# EAGLE schematic Main (EAGLE 8.6.1)
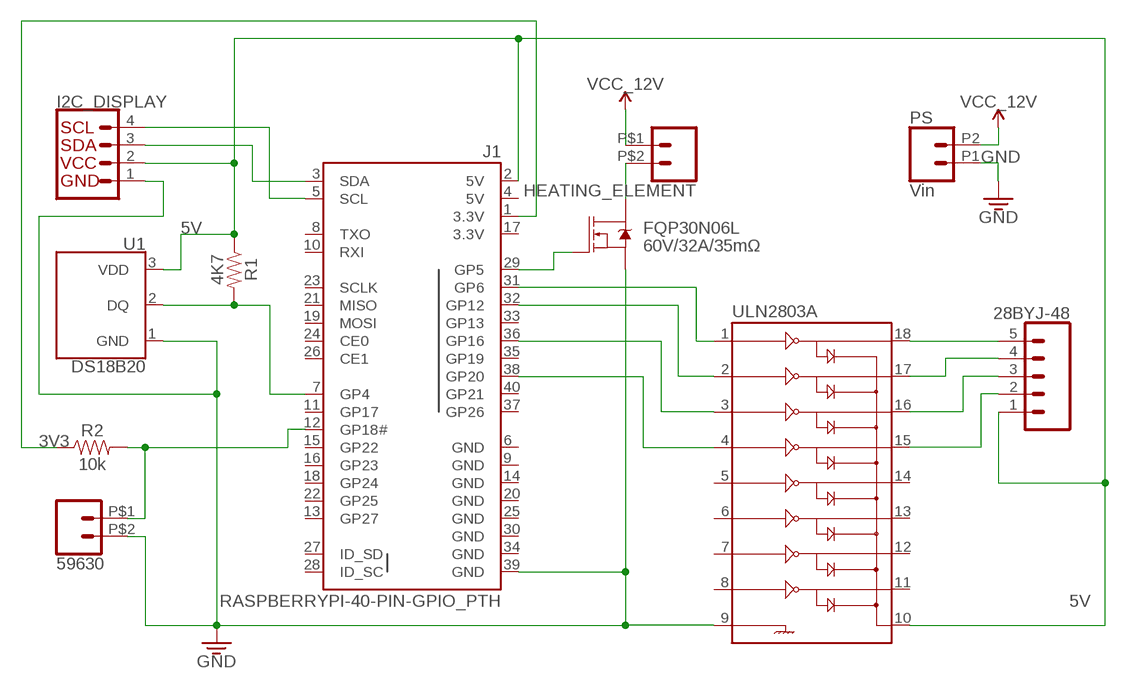
[diagram p0: schematic, sheet 1]

## Parts
28BYJ-48  CONN_05SCREW  [SCREWTERMINAL-3.5MM-5]
59630  CONN_02PTH2  [1X02_BIG]
FQP30N06L  60V/32A/35mΩ  MOSFET-NCH-FQP30N06L  [TO220V]
HEATING_ELEMENT  CONN_02PTH2  [1X02_BIG]
I2C_DISPLAY  I2C_STANDARD  [1X04]
J1  RASPBERRYPI-40-PIN-GPIO_PTH  [2X20_SHROUDED]
PS  Vin  CONN_022.54MM_SCREWTERM  [1X02_2.54_SCREWTERM]
R1  4K7  RESISTORAXIAL-0.3  [AXIAL-0.3]
R2  10k  10KOHM-HORIZ-1/4W-1%  [AXIAL-0.3]
U1  DS18B20  [TO-92-AMMO]
ULN2803A  ULN2803DIP  [DIL18]

## Nets
3V3: J1.1(3.3V) R2.P$1
5V: 28BYJ-48.1 I2C_DISPLAY.2 J1.2(5V) R1.P$1 U1.3(VDD) ULN2803A.10
12V: HEATING_ELEMENT.P$1 PS.P2 ; supply symbol labelled VCC_12V
DQ: J1.7(GP4) R1.P$2 U1.2(DQ)
GND: 59630.P$2 FQP30N06L.3(S) I2C_DISPLAY.1 J1.39(GND) PS.P1 U1.1(GND) ULN2803A.9
N$2: J1.31(GP6) ULN2803A.1
N$3: FQP30N06L.1(G) J1.29(GP5)
N$4: J1.36(GP16) ULN2803A.3
N$5: J1.38(GP20) ULN2803A.4
N$8: FQP30N06L.2(D) HEATING_ELEMENT.P$2
N$10: J1.32(GP12) ULN2803A.2
N$13: 28BYJ-48.5 ULN2803A.18
N$14: 28BYJ-48.4 ULN2803A.17
N$15: 28BYJ-48.3 ULN2803A.16
N$16: 28BYJ-48.2 ULN2803A.15
SCL: I2C_DISPLAY.4 J1.5(SCL)
SDA: I2C_DISPLAY.3 J1.3(SDA)
WS: 59630.P$1 J1.12(GP18#) R2.P$2
Unconnected: J1.8(TXO) J1.10(RXI) J1.11(GP17) J1.13(GP27) J1.15(GP22) J1.16(GP23) J1.18(GP24) J1.19(MOSI) J1.21(MISO) J1.22(GP25) J1.23(SCLK) J1.24(CE0) J1.26(CE1) J1.27(ID_SD) J1.28(ID_SC) J1.33(GP13) J1.35(GP19) J1.37(GP26) J1.40(GP21) ULN2803A.5 ULN2803A.6 ULN2803A.7 ULN2803A.8 ULN2803A.11 ULN2803A.12 ULN2803A.13 ULN2803A.14

## Power pins joined to a net without a drawn wire
3.3V: J1.17(3.3V)
5V: J1.4(5V)
GND: J1.6(GND) J1.9(GND) J1.14(GND) J1.20(GND) J1.25(GND) J1.30(GND) J1.34(GND)

## Library data of the parts
28BYJ-48 = SparkFun-Connectors:CONN_05: Multi connection point. Often used as Generic Header-pin footprint for 0.1 inch spaced/style header connections On any of the 0.1 inch spaced packages, you can populate with these: Break Away Headers - Straight <https://www.sparkfun.com/products/116> (PRT-00116) Break Away Male Headers - Right Angle <https://www.sparkfun.com/products/553> (PRT-00553) Female Headers <https://www.sparkfun.com/products/115> (PRT-00115) Break Away Headers - Machine Pin <https://www.sparkfun.com/products/117> (PRT-00117) Break Away Female Headers - Swiss Machine Pin <https://www.sparkfun.com/products/743> (PRT-00743) For SCREWTERMINALS and SPRING TERMINALS visit here: Screw Terimnals on SparkFun.com <https://www.sparkfun.com/search/results?term=Screw+Terminals> (5mm/3.5mm/2.54mm spacing) This device is also useful as a general connection point to wire up your design to another part of your project. Our various solder wires solder well into these plated through hole pads. Hook-Up Wire - Assortment (Stranded, 22 AWG) <https://www.sparkfun.com/products/11375> (PRT-11375) Hook-Up Wire - Assortment (Solid Core, 22 AWG) <https://www.sparkfun.com/products/11367> (PRT-11367) View the entire wire category on our website here <https://www.sparkfun.com/categories/141> Special notes: Molex polarized connector foot print use with SKU : PRT-08231 with associated crimp pins and housings. 1MM SMD Version SKU: PRT-10208; PROD_ID: Combine 8288+8399; SPICEPREFIX: X
59630 HEATING_ELEMENT PS = SparkFun-Connectors:CONN_02: Multi connection point. Often used as Generic Header-pin footprint for 0.1 inch spaced/style header connections On any of the 0.1 inch spaced packages, you can populate with these: Break Away Headers - Straight <https://www.sparkfun.com/products/116> (PRT-00116) Break Away Male Headers - Right Angle <https://www.sparkfun.com/products/553> (PRT-00553) Female Headers <https://www.sparkfun.com/products/115> (PRT-00115) Break Away Headers - Machine Pin <https://www.sparkfun.com/products/117> (PRT-00117) Break Away Female Headers - Swiss Machine Pin <https://www.sparkfun.com/products/743> (PRT-00743) For SCREWTERMINALS and SPRING TERMINALS visit here: Screw Terimnals on SparkFun.com <https://www.sparkfun.com/search/results?term=Screw+Terminals> (5mm/3.5mm/2.54mm spacing) This device is also useful as a general connection point to wire up your design to another part of your project. Our various solder wires solder well into these plated through hole pads. Hook-Up Wire - Assortment (Stranded, 22 AWG) <https://www.sparkfun.com/products/11375> (PRT-11375) Hook-Up Wire - Assortment (Solid Core, 22 AWG) <https://www.sparkfun.com/products/11367> (PRT-11367) View the entire wire category on our website here <https://www.sparkfun.com/categories/141> Special notes: Molex polarized connector foot print use with: PRT-08233 with associated crimp pins and housings. 2.54_SCREWTERM for use with PRT-10571. 3.5mm Screw Terminal footprints for PRT-08084 5mm Screw Terminal footprints for use with PRT-08432
FQP30N06L = SparkFun-DiscreteSemi:MOSFET-NCH: N-channel MOSFETs Voltage controlled devices that allow control of high current outputs. SparkFun Products: SparkFun OpenScale <https://www.sparkfun.com/products/13261> SparkFun Digital Sandbox <https://www.sparkfun.com/products/12651> SparkFun Monster Moto Shield <https://www.sparkfun.com/products/10182> SparkFun MOSFET Power Controller <https://www.sparkfun.com/products/11214>; PROD_ID: TRANS-10060
I2C_DISPLAY = SparkFun-Connectors:I2C_STANDARD: SparkFun I2C Standard Pinout Header SparkFun has standardized on a pinout for all I2C based sensor breakouts. This pinout allows I2C boards to be plugged directly into the headers on Arduino Uno compatible boards, and to be daisy chained easily. Example SparkFun Products: SparkFun Atmospheric Sensor Breakout - BME280 <https://www.sparkfun.com/products/13676> SparkFun Altitude/Pressure Sensor Breakout - MPL3115A2 <https://www.sparkfun.com/products/11084> SparkFun TOF Range Finder Sensor - VL6180 <https://www.sparkfun.com/products/12785>; SPICEPREFIX: E
J1 = SparkFun-Connectors:RASPBERRYPI-40-PIN-GPIO: Raspberry Pi GPIO Header 2x20 pin connector, as found on B, B+, A+ models. Both shrouded PTH and SMT versions available. SparkFun Products: GPIO Shrouded Header <https://www.sparkfun.com/products/13054>- PTH SparkFun Pi Wedge (Preassembled) <https://www.sparkfun.com/products/13717>; PROD_ID: CONN-12263; SF_ID: PRT-13054
R1 = SparkFun-Resistors:RESISTOR: Generic Resistor Package
R2 = SparkFun-Resistors:10KOHM: 10kΩ resistor A resistor is a passive two-terminal electrical component that implements electrical resistance as a circuit element. Resistors act to reduce current flow, and, at the same time, act to lower voltage levels within circuits. - Wikipedia; PROD_ID: RES-12183
U1 = SparkFun-Sensors:DS18B20: Dallas/Maxim DS18B20 1-Wire Temperature Sensor The DS18B20 reports degrees C with 9 to 12-bit precision, -55C to 125C (+/-0.5C). Each sensor has a unique 64-Bit Serial number etched into it - allows for a huge number of sensors to be used on one data bus. Datasheet <http://datasheets.maximintegrated.com/en/ds/DS18B20.pdf> SparkFun Products One Wire Digital Temperature Sensor - DS18B20 <https://www.sparkfun.com/products/245> (SEN-00245); SPICEPREFIX: U; STORE_ID: SEN-00245
ULN2803A = SparkFun-IC-Special-Function:ULN2803: Darlington Driver(IC-07959, low stock) ULN2803 Darlington array. 500mA max per channel, 8-channel package. Spark Fun Electronics SKU : COM-00312